# Altium project LEDBO_LRTBR98G_72.PrjPcb
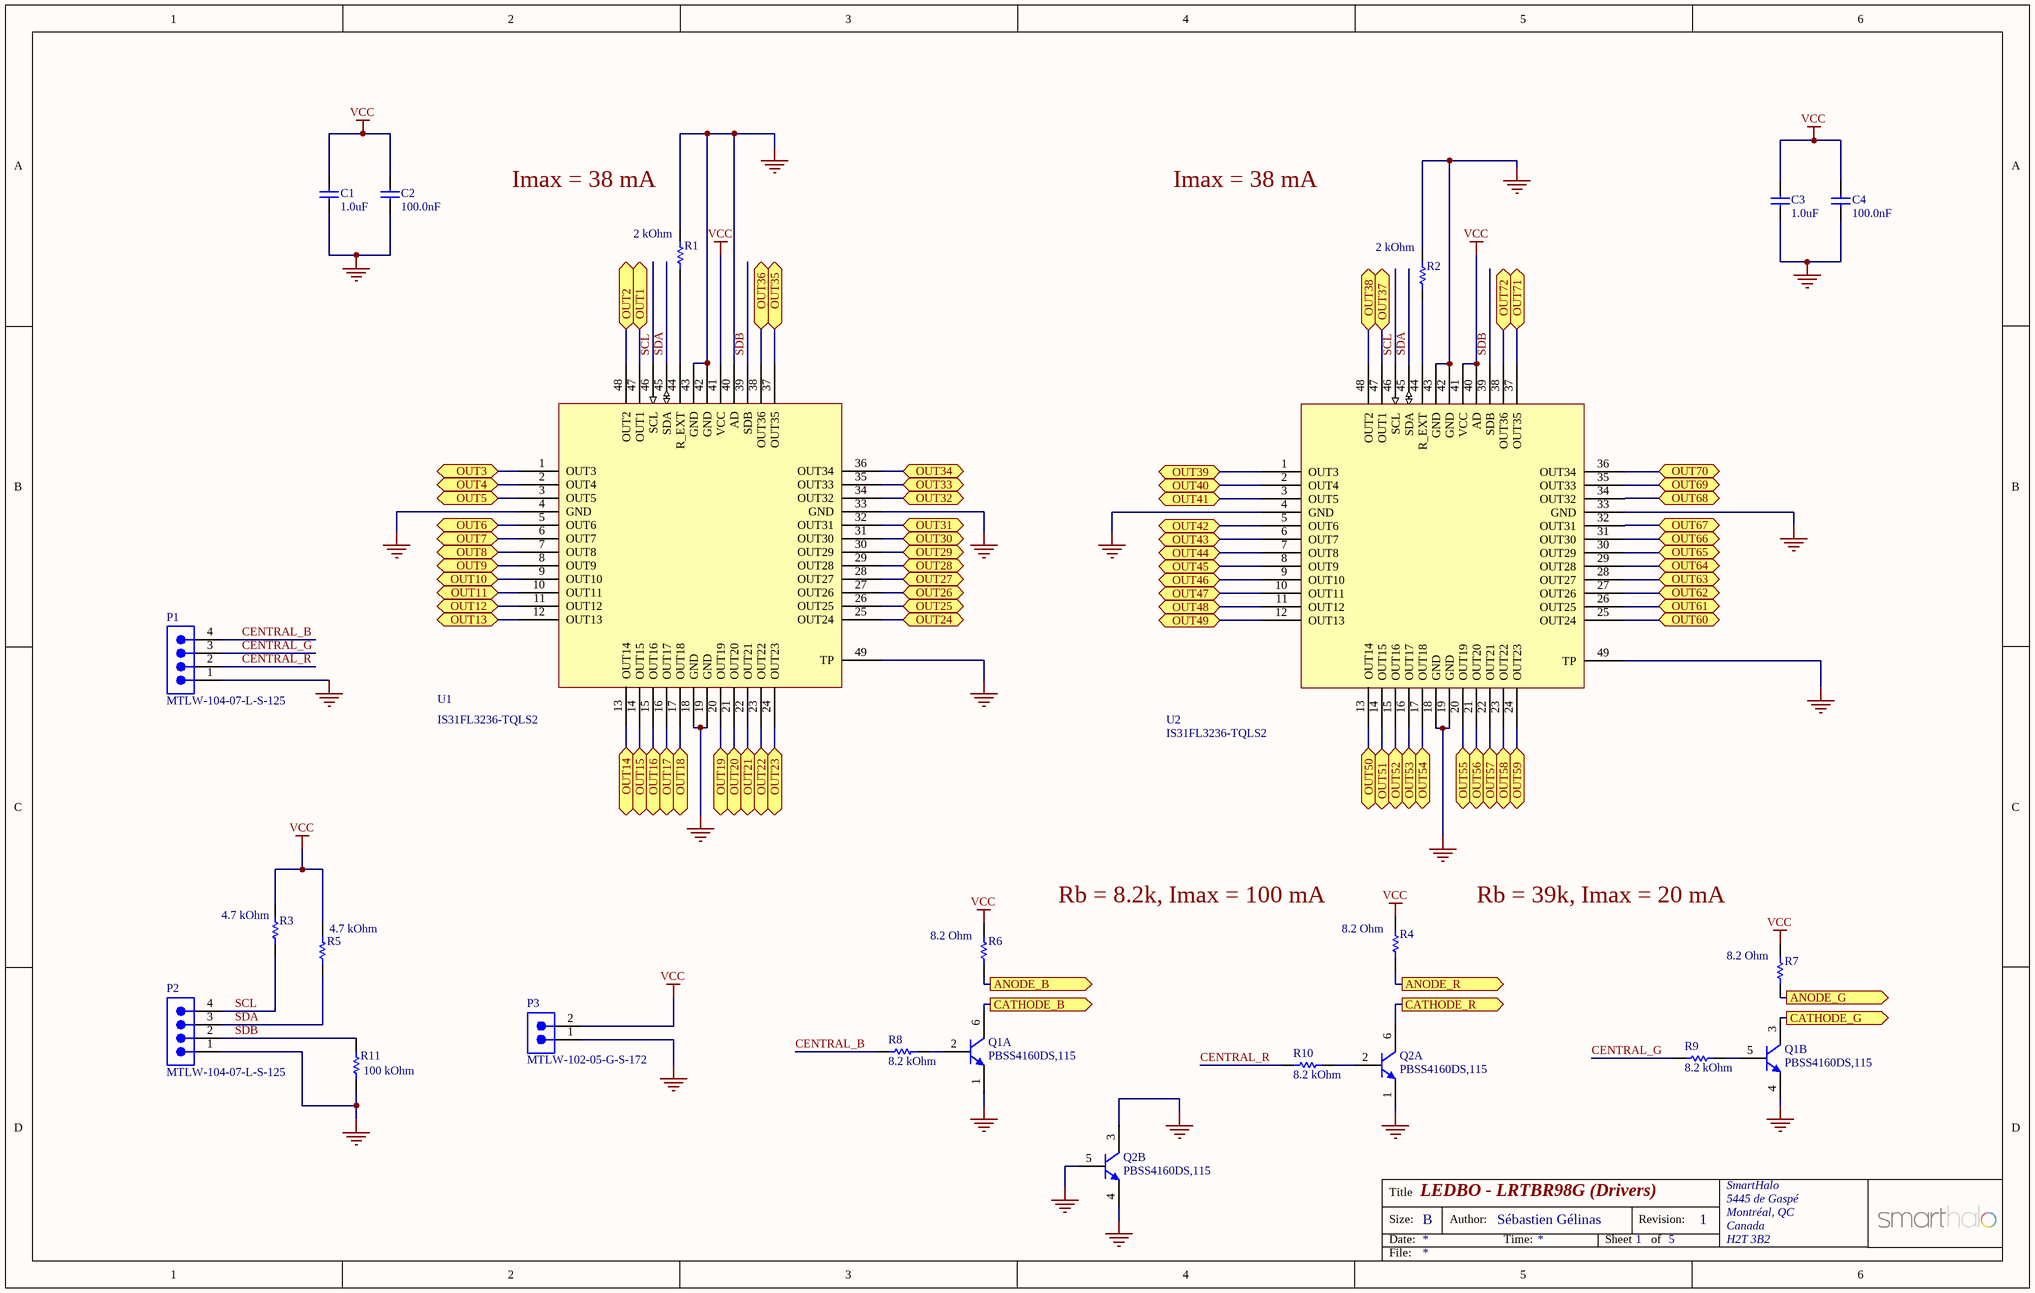
[diagram p0: DRIVERS_CONNECTORS.SchDoc]
5 sheets, 99 parts. Net scope: flat (ports and power ports of the same name join across sheets).
Sheets:
  DRIVERS_CONNECTORS.SchDoc
  LEDS1.SchDoc
  CENTRALLEDS.SchDoc
  LEDS2.SchDoc
  LEDS3.SchDoc

## Sheet DRIVERS_CONNECTORS.SchDoc: LEDBO - LRTBR98G (Drivers)
size B; Author: Sébastien Gélinas; Organization: SmartHalo; Address1: 5445 de Gaspé; Address2: Montréal, QC; Address3: Canada; Address4: H2T 3B2; Revision: 1; SheetNumber: 1; SheetTotal: 5

### Parts
C1  1.0uF  [CAPC0603(1608)100_N]
C2  100.0nF  [CAPC0603(1608)100_N]
C3  1.0uF  [CAPC0603(1608)100_N]
C4  100.0nF  [CAPC0603(1608)100_N]
P1  MTLW-104-07-L-S-125  [SMTC-MTLW-104-07-X-S-125]  (no BOM)
P2  MTLW-104-07-L-S-125  [SMTC-MTLW-104-07-X-S-125]  (no BOM)
P3  MTLW-102-05-G-S-172  [SMTC-MTLW-102-05-X-S-172]  (no BOM)
Q1  PBSS4160DS,115  [NXP-SC74_M]  (parts A,B of 2)
Q2  PBSS4160DS,115  [NXP-SC74_M]  (parts A,B of 2)
R1  2 kOhm  [RESC0603(1608)_N]
R2  2 kOhm  [RESC0603(1608)_N]
R3  4.7 kOhm  [RESC0603(1608)_N]
R4  8.2 Ohm  [RESC0603(1608)_N]
R5  4.7 kOhm  [RESC0603(1608)_N]
R6  8.2 Ohm  [RESC0603(1608)_N]
R7  8.2 Ohm  [RESC0603(1608)_N]
R8  8.2 kOhm  [RESC0603(1608)_N]
R9  8.2 kOhm  [RESC0603(1608)_N]
R10  8.2 kOhm  [RESC0603(1608)_N]
R11  100 kOhm  [RESC0603(1608)_N]
U1  IS31FL3236-TQLS2  [TQFP48]
U2  IS31FL3236-TQLS2  [TQFP48]

### Ports
ANODE_B (out), ANODE_G (out), ANODE_R (out), CATHODE_B (out), CATHODE_G (out), CATHODE_R (out), OUT1, OUT2, OUT3, OUT4, OUT5, OUT6, OUT7, OUT8, OUT9, OUT10, OUT11, OUT12, OUT13, OUT14, OUT15, OUT16, OUT17, OUT18, OUT19, OUT20, OUT21, OUT22, OUT23, OUT24, OUT25, OUT26, OUT27, OUT28, OUT29, OUT30, OUT31, OUT32, OUT33, OUT34, OUT35, OUT36, OUT37, OUT38, OUT39, OUT40, OUT41, OUT42, OUT43, OUT44, OUT45, OUT46, OUT47, OUT48, OUT49, OUT50, OUT51, OUT52, OUT53, OUT54, OUT55, OUT56, OUT57, OUT58, OUT59, OUT60, OUT61, OUT62, OUT63, OUT64, OUT65, OUT66, OUT67, OUT68, OUT69, OUT70, OUT71, OUT72

### Nets
GND: C1.2 C2.2 C3.2 C4.2 P1.1 P2.1 P3.1 Q1.1(E1) Q1.4(E2) Q2.1(E1) Q2.3(C2) Q2.4(E2) Q2.5(B2) R1.2 R2.2 R11.1 U1.4(GND) U1.18(GND) U1.19(GND) U1.33(GND) U1.40(AD) U1.42(GND) U1.43(GND) U1.49(TP) U2.4(GND) U2.18(GND) U2.19(GND) U2.33(GND) U2.42(GND) U2.43(GND) U2.49(TP)
VCC: C1.1 C2.1 C3.1 C4.1 P3.2 R3.2 R4.2 R5.2 R6.2 R7.2 U1.41(VCC) U2.40(AD) U2.41(VCC)
ANODE_B: R6.1 ; port ANODE_B
ANODE_G: R7.1 ; port ANODE_G
ANODE_R: R4.1 ; port ANODE_R
CENTRAL_B: P1.4 R8.2
CENTRAL_G: P1.3 R9.2
CENTRAL_R: P1.2 R10.2
SCL: P2.4 R3.1 U1.46(SCL) U2.46(SCL)
SDA: P2.3 R5.1 U1.45(SDA) U2.45(SDA)
SDB: P2.2 R11.2 U1.39(SDB) U2.39(SDB)
NetLED1_C1: Q1.6(C1) ; port CATHODE_B
NetLED1_C2: Q1.3(C2) ; port CATHODE_G
NetLED1_C3: Q2.6(C1) ; port CATHODE_R
NetLED6_C1: U1.20(OUT19) ; port OUT19
NetLED6_C2: U1.21(OUT20) ; port OUT20
NetLED6_C3: U1.22(OUT21) ; port OUT21
NetLED7_C1: U1.15(OUT16) ; port OUT16
NetLED7_C2: U1.16(OUT17) ; port OUT17
NetLED7_C3: U1.17(OUT18) ; port OUT18
NetLED8_C1: U1.12(OUT13) ; port OUT13
NetLED8_C2: U1.13(OUT14) ; port OUT14
NetLED8_C3: U1.14(OUT15) ; port OUT15
NetLED9_C1: U1.9(OUT10) ; port OUT10
NetLED9_C2: U1.10(OUT11) ; port OUT11
NetLED9_C3: U1.11(OUT12) ; port OUT12
NetLED10_C1: U1.6(OUT7) ; port OUT7
NetLED10_C2: U1.7(OUT8) ; port OUT8
NetLED10_C3: U1.8(OUT9) ; port OUT9
NetLED11_C1: U1.2(OUT4) ; port OUT4
NetLED11_C2: U1.3(OUT5) ; port OUT5
NetLED11_C3: U1.5(OUT6) ; port OUT6
NetLED12_C1: U1.47(OUT1) ; port OUT1
NetLED12_C2: U1.48(OUT2) ; port OUT2
NetLED12_C3: U1.1(OUT3) ; port OUT3
NetLED13_C1: U2.36(OUT34) ; port OUT70
NetLED13_C2: U2.37(OUT35) ; port OUT71
NetLED13_C3: U2.38(OUT36) ; port OUT72
NetLED14_C1: U2.32(OUT31) ; port OUT67
NetLED14_C2: U2.34(OUT32) ; port OUT68
NetLED14_C3: U2.35(OUT33) ; port OUT69
NetLED15_C1: U2.29(OUT28) ; port OUT64
NetLED15_C2: U2.30(OUT29) ; port OUT65
NetLED15_C3: U2.31(OUT30) ; port OUT66
NetLED16_C1: U2.26(OUT25) ; port OUT61
NetLED16_C2: U2.27(OUT26) ; port OUT62
NetLED16_C3: U2.28(OUT27) ; port OUT63
NetLED17_C1: U2.23(OUT22) ; port OUT58
NetLED17_C2: U2.24(OUT23) ; port OUT59
NetLED17_C3: U2.25(OUT24) ; port OUT60
NetLED18_C1: U2.20(OUT19) ; port OUT55
NetLED18_C2: U2.21(OUT20) ; port OUT56
NetLED18_C3: U2.22(OUT21) ; port OUT57
NetLED19_C1: U2.15(OUT16) ; port OUT52
NetLED19_C2: U2.16(OUT17) ; port OUT53
NetLED19_C3: U2.17(OUT18) ; port OUT54
NetLED20_C1: U2.12(OUT13) ; port OUT49
NetLED20_C2: U2.13(OUT14) ; port OUT50
NetLED20_C3: U2.14(OUT15) ; port OUT51
NetLED21_C1: U2.9(OUT10) ; port OUT46
NetLED21_C2: U2.10(OUT11) ; port OUT47
NetLED21_C3: U2.11(OUT12) ; port OUT48
NetLED22_C1: U2.6(OUT7) ; port OUT43
NetLED22_C2: U2.7(OUT8) ; port OUT44
NetLED22_C3: U2.8(OUT9) ; port OUT45
NetLED23_C1: U2.2(OUT4) ; port OUT40
NetLED23_C2: U2.3(OUT5) ; port OUT41
NetLED23_C3: U2.5(OUT6) ; port OUT42
NetLED24_C1: U2.47(OUT1) ; port OUT37
NetLED24_C2: U2.48(OUT2) ; port OUT38
NetLED24_C3: U2.1(OUT3) ; port OUT39
NetLED25_C1: U1.36(OUT34) ; port OUT34
NetLED25_C2: U1.37(OUT35) ; port OUT35
NetLED25_C3: U1.38(OUT36) ; port OUT36
NetLED26_C1: U1.32(OUT31) ; port OUT31
NetLED26_C2: U1.34(OUT32) ; port OUT32
NetLED26_C3: U1.35(OUT33) ; port OUT33
NetLED27_C1: U1.29(OUT28) ; port OUT28
NetLED27_C2: U1.30(OUT29) ; port OUT29
NetLED27_C3: U1.31(OUT30) ; port OUT30
NetLED28_C1: U1.26(OUT25) ; port OUT25
NetLED28_C2: U1.27(OUT26) ; port OUT26
NetLED28_C3: U1.28(OUT27) ; port OUT27
NetLED29_C1: U1.23(OUT22) ; port OUT22
NetLED29_C2: U1.24(OUT23) ; port OUT23
NetLED29_C3: U1.25(OUT24) ; port OUT24
NetQ1_2: Q1.2(B1) R8.1
NetQ1_5: Q1.5(B2) R9.1
NetQ2_2: Q2.2(B1) R10.1
NetR1_1: R1.1 U1.44(R_EXT)
NetR2_1: R2.1 U2.44(R_EXT)

### Notes on the sheet
- (near R1) Imax = 38 mA
- Imax = 38 mA
- Rb = 8.2k, Imax = 100 mA
- Rb = 39k, Imax = 20 mA
- Title
- Size:
- Date:
- B
- Author:
- Time:
- Sheet
- Revision:
- of
- File:

### Library data of the parts
C1-C4 = CAP0603: Chip Cap 0603 X7R 10%; Part Number: C0402-1n0; Note: Chip Cap X7R 10%; Artikkelnr Noca: 20039223; Published: 2009-05-08; LatestRevisionDate: 2009-11-23; Publisher: Nordic Semiconductor; Manufacturer: *; Manufacturer Part Number: *; Datasheet: *; Footprint: 0603; Pin Count: 2; Supplier: *
  C1 C3: Value: 1.0uF
  C2 C4: Value: 100.0nF
P1 P2 = CMP-1024-00072-1: Low Profile .025" SQ Post Header, Through-hole, Vertical, -55 to 125 degC, 2.54 mm Pitch, 4-Pin, Male, RoHS; Manufacturer: Samtec; Pitch: 2.54 mm; PackageDescription: Low Profile Terminal Assembly; PartNumber: MTLW-104-07-L-S-125; PackageReference: MTLW-104-07-X-S-125; ComponentLink1Description: Manufacturer URL; ComponentLink2Description: Datasheet; ComponentLink2URL: http://www.samtec.com/documents/webfiles/pdf/MTLW_TH.PDF; ComponentLink3Description: Package Specification; Mounting Technology: Through-hole; ComponentLink3URL: http://www.samtec.com/documents/webfiles/cpdf/MTLW-1XX-XX-XX-X-XXX-XX-XX-MKT1.pdf; ComponentLink1URL: http://www.samtec.com; Orientation: Vertical; PackageVersion: T, 6/1991; DatasheetVersion: F-214; Temperature Range: -55 to 125 degC; RoHS: True
P3 = CMP-1024-00064-1: Low Profile .025" SQ Post Header, Through-hole, Vertical, -55 to 125 degC, 2.54 mm Pitch, 2-Pin, Male, RoHS; Manufacturer: Samtec; Pitch: 2.54 mm; ComponentLink2URL: http://www.samtec.com/documents/webfiles/pdf/MTLW_TH.PDF; PackageDescription: Low Profile Terminal Assembly; ComponentLink3URL: http://www.samtec.com/documents/webfiles/cpdf/MTLW-1XX-XX-XX-X-XXX-XX-XX-MKT1.pdf; PackageReference: MTLW-102-05-X-S-172; Mounting Technology: Through-hole; ComponentLink2Description: Datasheet; PackageVersion: T, 6/1991; Orientation: Vertical; DatasheetVersion: F-214; RoHS: True; ComponentLink3Description: Package Specification; ComponentLink1URL: http://www.samtec.com; Temperature Range: -55 to 125 degC; PartNumber: MTLW-102-05-G-S-172; ComponentLink1Description: Manufacturer URL
Q1 Q2 = PBSS4160DS,115: TRANS 2NPN 60V 1A 6TSOP; Manufacturer: NXP Semiconductors; Polarity: NPN; Mounting Technology: Surface Mount; PackageDescription: 6-Pin Semiconductor Package, 2.9 x 1.6 mm Body, 0.95 mm Pitch; PackageReference: SC74; PartNumber: PBSS4160DS; Manufacturer Part Number: PBSS4160DS,115; Digi-Key Part Number: 568-4350-1-ND
R1 R2 = CMP-1012-00090-1: 2k 0.1W 5% 0603 (1608 Metric)  SMD; Case-Metric: 1608; Case-EIA: 0603; Tolerance: 5 %; Technology: SMT; Power: 0.1 W; Value: 2 kOhm
R3 R5 = CMP-1012-00090-1: 4K7 0.1W 5% 0603 (1608 Metric)  SMD; Case-Metric: 1608; Case-EIA: 0603; Tolerance: 5 %; Technology: SMT; Power: 0.1 W; Value: 4.7 kOhm
R4 R6 R7 = CMP-1012-00090-1: 8R2 0.1W 5% 0603 (1608 Metric)  SMD; Case-Metric: 1608; Case-EIA: 0603; Tolerance: 5 %; Technology: SMT; Power: 0.1 W; Value: 8.2 Ohm
R8-R10 = CMP-1012-00090-1: 8K2 0.1W 5% 0603 (1608 Metric)  SMD; Case-Metric: 1608; Case-EIA: 0603; Tolerance: 5 %; Technology: SMT; Power: 0.1 W; Value: 8.2 kOhm
R11 = CMP-1012-00090-1: 100k 0.1W 5% 0603 (1608 Metric)  SMD; Case-Metric: 1608; Case-EIA: 0603; Tolerance: 5 %; Technology: SMT; Power: 0.1 W; Value: 100 kOhm
U1 U2 = IS31FL3236-TQLS2: IC 36 CHANNELS LED DRIVER; Manufacturer: ISSI; Manufacturer Part Number: IS31FL3236-TQLS2

## Sheet LEDS1.SchDoc: LEDBO - LRTBR98G (LEDS 1)
size B; Author: Sébastien Gélinas; Organization: SmartHalo; Address1: 5445 de Gaspé; Address2: Montréal, QC; Address3: Canada; Address4: H2T 3B2; Revision: 1; SheetNumber: 3; SheetTotal: 5
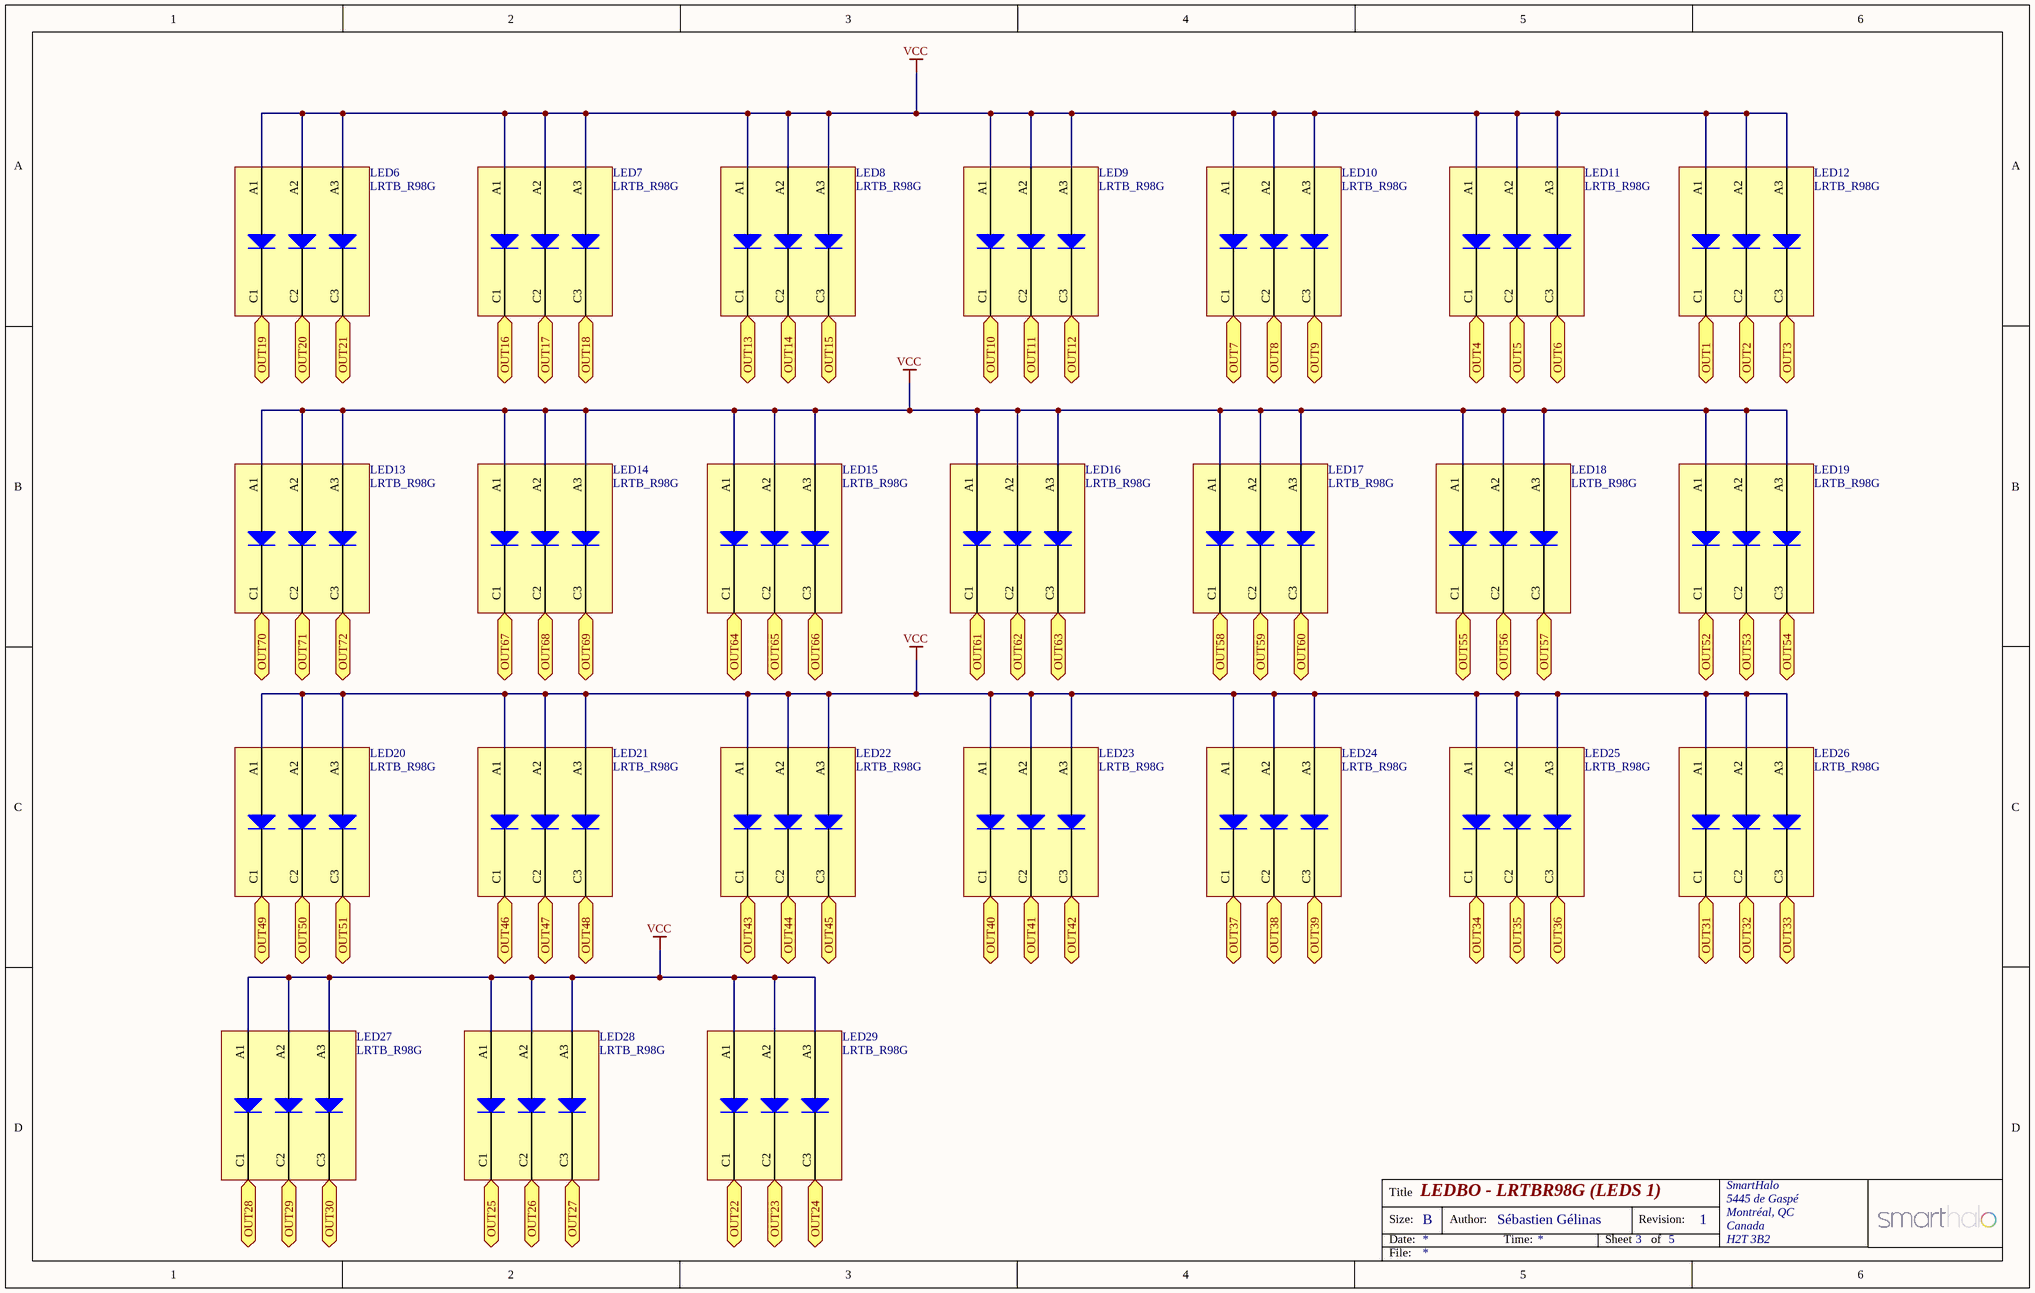
[diagram p1: LEDS1.SchDoc]

### Parts
LED6  LRTB_R98G  [LRTB_R98G]
LED7  LRTB_R98G  [LRTB_R98G]
LED8  LRTB_R98G  [LRTB_R98G]
LED9  LRTB_R98G  [LRTB_R98G]
LED10  LRTB_R98G  [LRTB_R98G]
LED11  LRTB_R98G  [LRTB_R98G]
LED12  LRTB_R98G  [LRTB_R98G]
LED13  LRTB_R98G  [LRTB_R98G]
LED14  LRTB_R98G  [LRTB_R98G]
LED15  LRTB_R98G  [LRTB_R98G]
LED16  LRTB_R98G  [LRTB_R98G]
LED17  LRTB_R98G  [LRTB_R98G]
LED18  LRTB_R98G  [LRTB_R98G]
LED19  LRTB_R98G  [LRTB_R98G]
LED20  LRTB_R98G  [LRTB_R98G]
LED21  LRTB_R98G  [LRTB_R98G]
LED22  LRTB_R98G  [LRTB_R98G]
LED23  LRTB_R98G  [LRTB_R98G]
LED24  LRTB_R98G  [LRTB_R98G]
LED25  LRTB_R98G  [LRTB_R98G]
LED26  LRTB_R98G  [LRTB_R98G]
LED27  LRTB_R98G  [LRTB_R98G]
LED28  LRTB_R98G  [LRTB_R98G]
LED29  LRTB_R98G  [LRTB_R98G]

### Ports
OUT1, OUT2, OUT3, OUT4, OUT5, OUT6, OUT7, OUT8, OUT9, OUT10, OUT11, OUT12, OUT13, OUT14, OUT15, OUT16, OUT17, OUT18, OUT19, OUT20, OUT21, OUT22, OUT23, OUT24, OUT25, OUT26, OUT27, OUT28, OUT29, OUT30, OUT31, OUT32, OUT33, OUT34, OUT35, OUT36, OUT37, OUT38, OUT39, OUT40, OUT41, OUT42, OUT43, OUT44, OUT45, OUT46, OUT47, OUT48, OUT49, OUT50, OUT51, OUT52, OUT53, OUT54, OUT55, OUT56, OUT57, OUT58, OUT59, OUT60, OUT61, OUT62, OUT63, OUT64, OUT65, OUT66, OUT67, OUT68, OUT69, OUT70, OUT71, OUT72

### Nets
VCC: LED6.A1(Anode_Blue) LED6.A2(Anode_Green) LED6.A3(Anode_Red) LED7.A1(Anode_Blue) LED7.A2(Anode_Green) LED7.A3(Anode_Red) LED8.A1(Anode_Blue) LED8.A2(Anode_Green) LED8.A3(Anode_Red) LED9.A1(Anode_Blue) LED9.A2(Anode_Green) LED9.A3(Anode_Red) LED10.A1(Anode_Blue) LED10.A2(Anode_Green) LED10.A3(Anode_Red) LED11.A1(Anode_Blue) LED11.A2(Anode_Green) LED11.A3(Anode_Red) LED12.A1(Anode_Blue) LED12.A2(Anode_Green) LED12.A3(Anode_Red) LED13.A1(Anode_Blue) LED13.A2(Anode_Green) LED13.A3(Anode_Red) LED14.A1(Anode_Blue) LED14.A2(Anode_Green) LED14.A3(Anode_Red) LED15.A1(Anode_Blue) LED15.A2(Anode_Green) LED15.A3(Anode_Red) LED16.A1(Anode_Blue) LED16.A2(Anode_Green) LED16.A3(Anode_Red) LED17.A1(Anode_Blue) LED17.A2(Anode_Green) LED17.A3(Anode_Red) LED18.A1(Anode_Blue) LED18.A2(Anode_Green) LED18.A3(Anode_Red) LED19.A1(Anode_Blue) LED19.A2(Anode_Green) LED19.A3(Anode_Red) LED20.A1(Anode_Blue) LED20.A2(Anode_Green) LED20.A3(Anode_Red) LED21.A1(Anode_Blue) LED21.A2(Anode_Green) LED21.A3(Anode_Red) LED22.A1(Anode_Blue) LED22.A2(Anode_Green) LED22.A3(Anode_Red) LED23.A1(Anode_Blue) LED23.A2(Anode_Green) LED23.A3(Anode_Red) LED24.A1(Anode_Blue) LED24.A2(Anode_Green) LED24.A3(Anode_Red) LED25.A1(Anode_Blue) LED25.A2(Anode_Green) LED25.A3(Anode_Red) LED26.A1(Anode_Blue) LED26.A2(Anode_Green) LED26.A3(Anode_Red) LED27.A1(Anode_Blue) LED27.A2(Anode_Green) LED27.A3(Anode_Red) LED28.A1(Anode_Blue) LED28.A2(Anode_Green) LED28.A3(Anode_Red) LED29.A1(Anode_Blue) LED29.A2(Anode_Green) LED29.A3(Anode_Red)
NetLED6_C1: LED6.C1(Cathode_Blue) ; port OUT19
NetLED6_C2: LED6.C2(Cathode_Green) ; port OUT20
NetLED6_C3: LED6.C3(Cathode_Red) ; port OUT21
NetLED7_C1: LED7.C1(Cathode_Blue) ; port OUT16
NetLED7_C2: LED7.C2(Cathode_Green) ; port OUT17
NetLED7_C3: LED7.C3(Cathode_Red) ; port OUT18
NetLED8_C1: LED8.C1(Cathode_Blue) ; port OUT13
NetLED8_C2: LED8.C2(Cathode_Green) ; port OUT14
NetLED8_C3: LED8.C3(Cathode_Red) ; port OUT15
NetLED9_C1: LED9.C1(Cathode_Blue) ; port OUT10
NetLED9_C2: LED9.C2(Cathode_Green) ; port OUT11
NetLED9_C3: LED9.C3(Cathode_Red) ; port OUT12
NetLED10_C1: LED10.C1(Cathode_Blue) ; port OUT7
NetLED10_C2: LED10.C2(Cathode_Green) ; port OUT8
NetLED10_C3: LED10.C3(Cathode_Red) ; port OUT9
NetLED11_C1: LED11.C1(Cathode_Blue) ; port OUT4
NetLED11_C2: LED11.C2(Cathode_Green) ; port OUT5
NetLED11_C3: LED11.C3(Cathode_Red) ; port OUT6
NetLED12_C1: LED12.C1(Cathode_Blue) ; port OUT1
NetLED12_C2: LED12.C2(Cathode_Green) ; port OUT2
NetLED12_C3: LED12.C3(Cathode_Red) ; port OUT3
NetLED13_C1: LED13.C1(Cathode_Blue) ; port OUT70
NetLED13_C2: LED13.C2(Cathode_Green) ; port OUT71
NetLED13_C3: LED13.C3(Cathode_Red) ; port OUT72
NetLED14_C1: LED14.C1(Cathode_Blue) ; port OUT67
NetLED14_C2: LED14.C2(Cathode_Green) ; port OUT68
NetLED14_C3: LED14.C3(Cathode_Red) ; port OUT69
NetLED15_C1: LED15.C1(Cathode_Blue) ; port OUT64
NetLED15_C2: LED15.C2(Cathode_Green) ; port OUT65
NetLED15_C3: LED15.C3(Cathode_Red) ; port OUT66
NetLED16_C1: LED16.C1(Cathode_Blue) ; port OUT61
NetLED16_C2: LED16.C2(Cathode_Green) ; port OUT62
NetLED16_C3: LED16.C3(Cathode_Red) ; port OUT63
NetLED17_C1: LED17.C1(Cathode_Blue) ; port OUT58
NetLED17_C2: LED17.C2(Cathode_Green) ; port OUT59
NetLED17_C3: LED17.C3(Cathode_Red) ; port OUT60
NetLED18_C1: LED18.C1(Cathode_Blue) ; port OUT55
NetLED18_C2: LED18.C2(Cathode_Green) ; port OUT56
NetLED18_C3: LED18.C3(Cathode_Red) ; port OUT57
NetLED19_C1: LED19.C1(Cathode_Blue) ; port OUT52
NetLED19_C2: LED19.C2(Cathode_Green) ; port OUT53
NetLED19_C3: LED19.C3(Cathode_Red) ; port OUT54
NetLED20_C1: LED20.C1(Cathode_Blue) ; port OUT49
NetLED20_C2: LED20.C2(Cathode_Green) ; port OUT50
NetLED20_C3: LED20.C3(Cathode_Red) ; port OUT51
NetLED21_C1: LED21.C1(Cathode_Blue) ; port OUT46
NetLED21_C2: LED21.C2(Cathode_Green) ; port OUT47
NetLED21_C3: LED21.C3(Cathode_Red) ; port OUT48
NetLED22_C1: LED22.C1(Cathode_Blue) ; port OUT43
NetLED22_C2: LED22.C2(Cathode_Green) ; port OUT44
NetLED22_C3: LED22.C3(Cathode_Red) ; port OUT45
NetLED23_C1: LED23.C1(Cathode_Blue) ; port OUT40
NetLED23_C2: LED23.C2(Cathode_Green) ; port OUT41
NetLED23_C3: LED23.C3(Cathode_Red) ; port OUT42
NetLED24_C1: LED24.C1(Cathode_Blue) ; port OUT37
NetLED24_C2: LED24.C2(Cathode_Green) ; port OUT38
NetLED24_C3: LED24.C3(Cathode_Red) ; port OUT39
NetLED25_C1: LED25.C1(Cathode_Blue) ; port OUT34
NetLED25_C2: LED25.C2(Cathode_Green) ; port OUT35
NetLED25_C3: LED25.C3(Cathode_Red) ; port OUT36
NetLED26_C1: LED26.C1(Cathode_Blue) ; port OUT31
NetLED26_C2: LED26.C2(Cathode_Green) ; port OUT32
NetLED26_C3: LED26.C3(Cathode_Red) ; port OUT33
NetLED27_C1: LED27.C1(Cathode_Blue) ; port OUT28
NetLED27_C2: LED27.C2(Cathode_Green) ; port OUT29
NetLED27_C3: LED27.C3(Cathode_Red) ; port OUT30
NetLED28_C1: LED28.C1(Cathode_Blue) ; port OUT25
NetLED28_C2: LED28.C2(Cathode_Green) ; port OUT26
NetLED28_C3: LED28.C3(Cathode_Red) ; port OUT27
NetLED29_C1: LED29.C1(Cathode_Blue) ; port OUT22
NetLED29_C2: LED29.C2(Cathode_Green) ; port OUT23
NetLED29_C3: LED29.C3(Cathode_Red) ; port OUT24

### Notes on the sheet
- Title
- Size:
- Date:
- B
- Author:
- Time:
- Sheet
- Revision:
- of
- File:

### Library data of the parts
LED6-LED29 = LRTB_R98G: IC RGB LED OSRAM; Manufacturer: OSRAM

## Sheet CENTRALLEDS.SchDoc: LEDBO - LRTBR98G (Central LED)
size B; Author: Sébastien Gélinas; Organization: SmartHalo; Address1: 5445 de Gaspé; Address2: Montréal, QC; Address3: Canada; Address4: H2T 3B2; Revision: 1; SheetNumber: 2; SheetTotal: 5
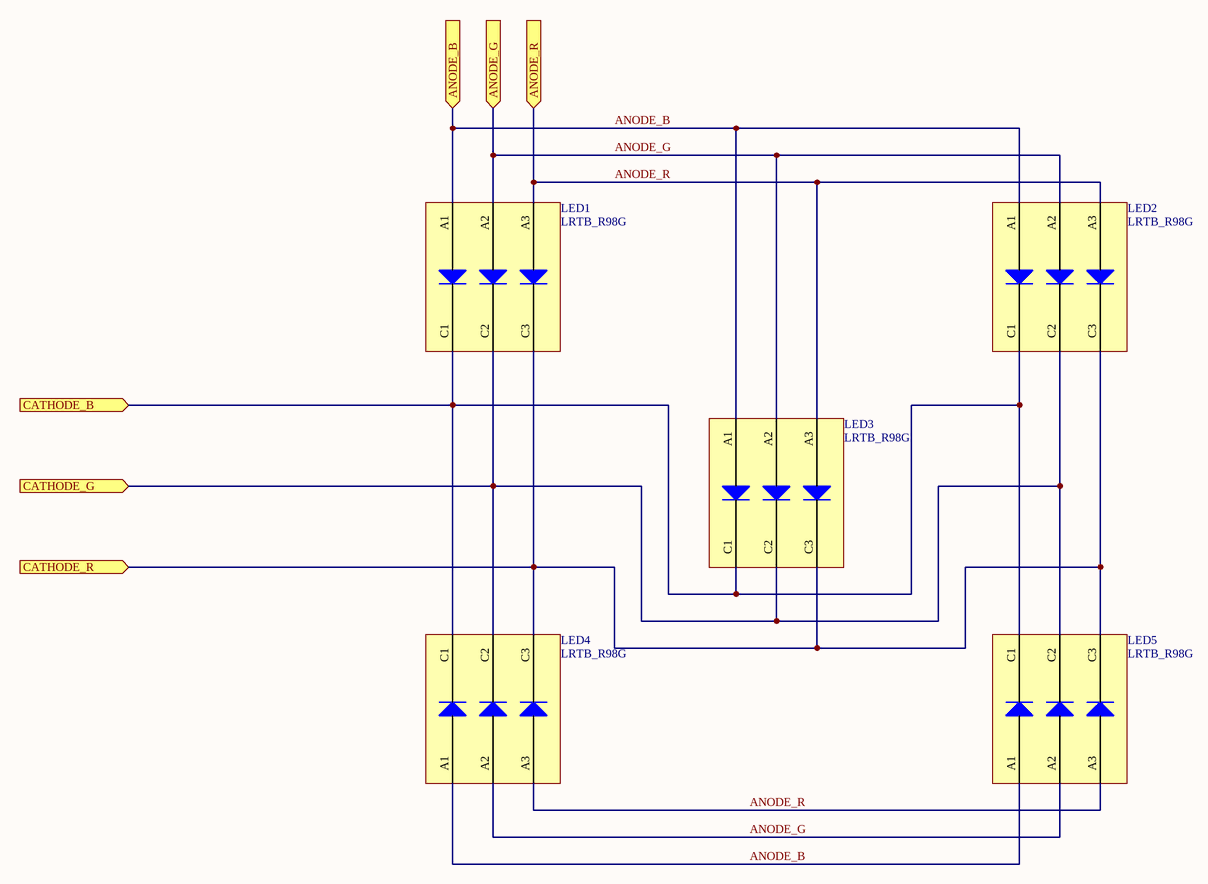
[diagram p2: CENTRALLEDS.SchDoc]

### Parts
LED1  LRTB_R98G  [LRTB_R98G]
LED2  LRTB_R98G  [LRTB_R98G]
LED3  LRTB_R98G  [LRTB_R98G]
LED4  LRTB_R98G  [LRTB_R98G]
LED5  LRTB_R98G  [LRTB_R98G]

### Ports
ANODE_B (in), ANODE_G (in), ANODE_R (in), CATHODE_B (in), CATHODE_G (in), CATHODE_R (in)

### Nets
ANODE_B: LED1.A1(Anode_Blue) LED2.A1(Anode_Blue) LED3.A1(Anode_Blue) LED4.A1(Anode_Blue) LED5.A1(Anode_Blue) ; port ANODE_B
ANODE_G: LED1.A2(Anode_Green) LED2.A2(Anode_Green) LED3.A2(Anode_Green) LED4.A2(Anode_Green) LED5.A2(Anode_Green) ; port ANODE_G
ANODE_R: LED1.A3(Anode_Red) LED2.A3(Anode_Red) LED3.A3(Anode_Red) LED4.A3(Anode_Red) LED5.A3(Anode_Red) ; port ANODE_R
NetLED1_C1: LED1.C1(Cathode_Blue) LED2.C1(Cathode_Blue) LED3.C1(Cathode_Blue) LED4.C1(Cathode_Blue) LED5.C1(Cathode_Blue) ; port CATHODE_B
NetLED1_C2: LED1.C2(Cathode_Green) LED2.C2(Cathode_Green) LED3.C2(Cathode_Green) LED4.C2(Cathode_Green) LED5.C2(Cathode_Green) ; port CATHODE_G
NetLED1_C3: LED1.C3(Cathode_Red) LED2.C3(Cathode_Red) LED3.C3(Cathode_Red) LED4.C3(Cathode_Red) LED5.C3(Cathode_Red) ; port CATHODE_R

### Notes on the sheet
- Title
- Size:
- Date:
- B
- Author:
- Time:
- Sheet
- Revision:
- of
- File:

### Library data of the parts
LED1-LED5 = LRTB_R98G: IC RGB LED OSRAM; Manufacturer: OSRAM

## Sheet LEDS2.SchDoc: LEDBO - LRTBR98G (LEDS 2)
size B; Author: Sébastien Gélinas; Organization: SmartHalo; Address1: 5445 de Gaspé; Address2: Montréal, QC; Address3: Canada; Address4: H2T 3B2; Revision: 1; SheetNumber: 4; SheetTotal: 5
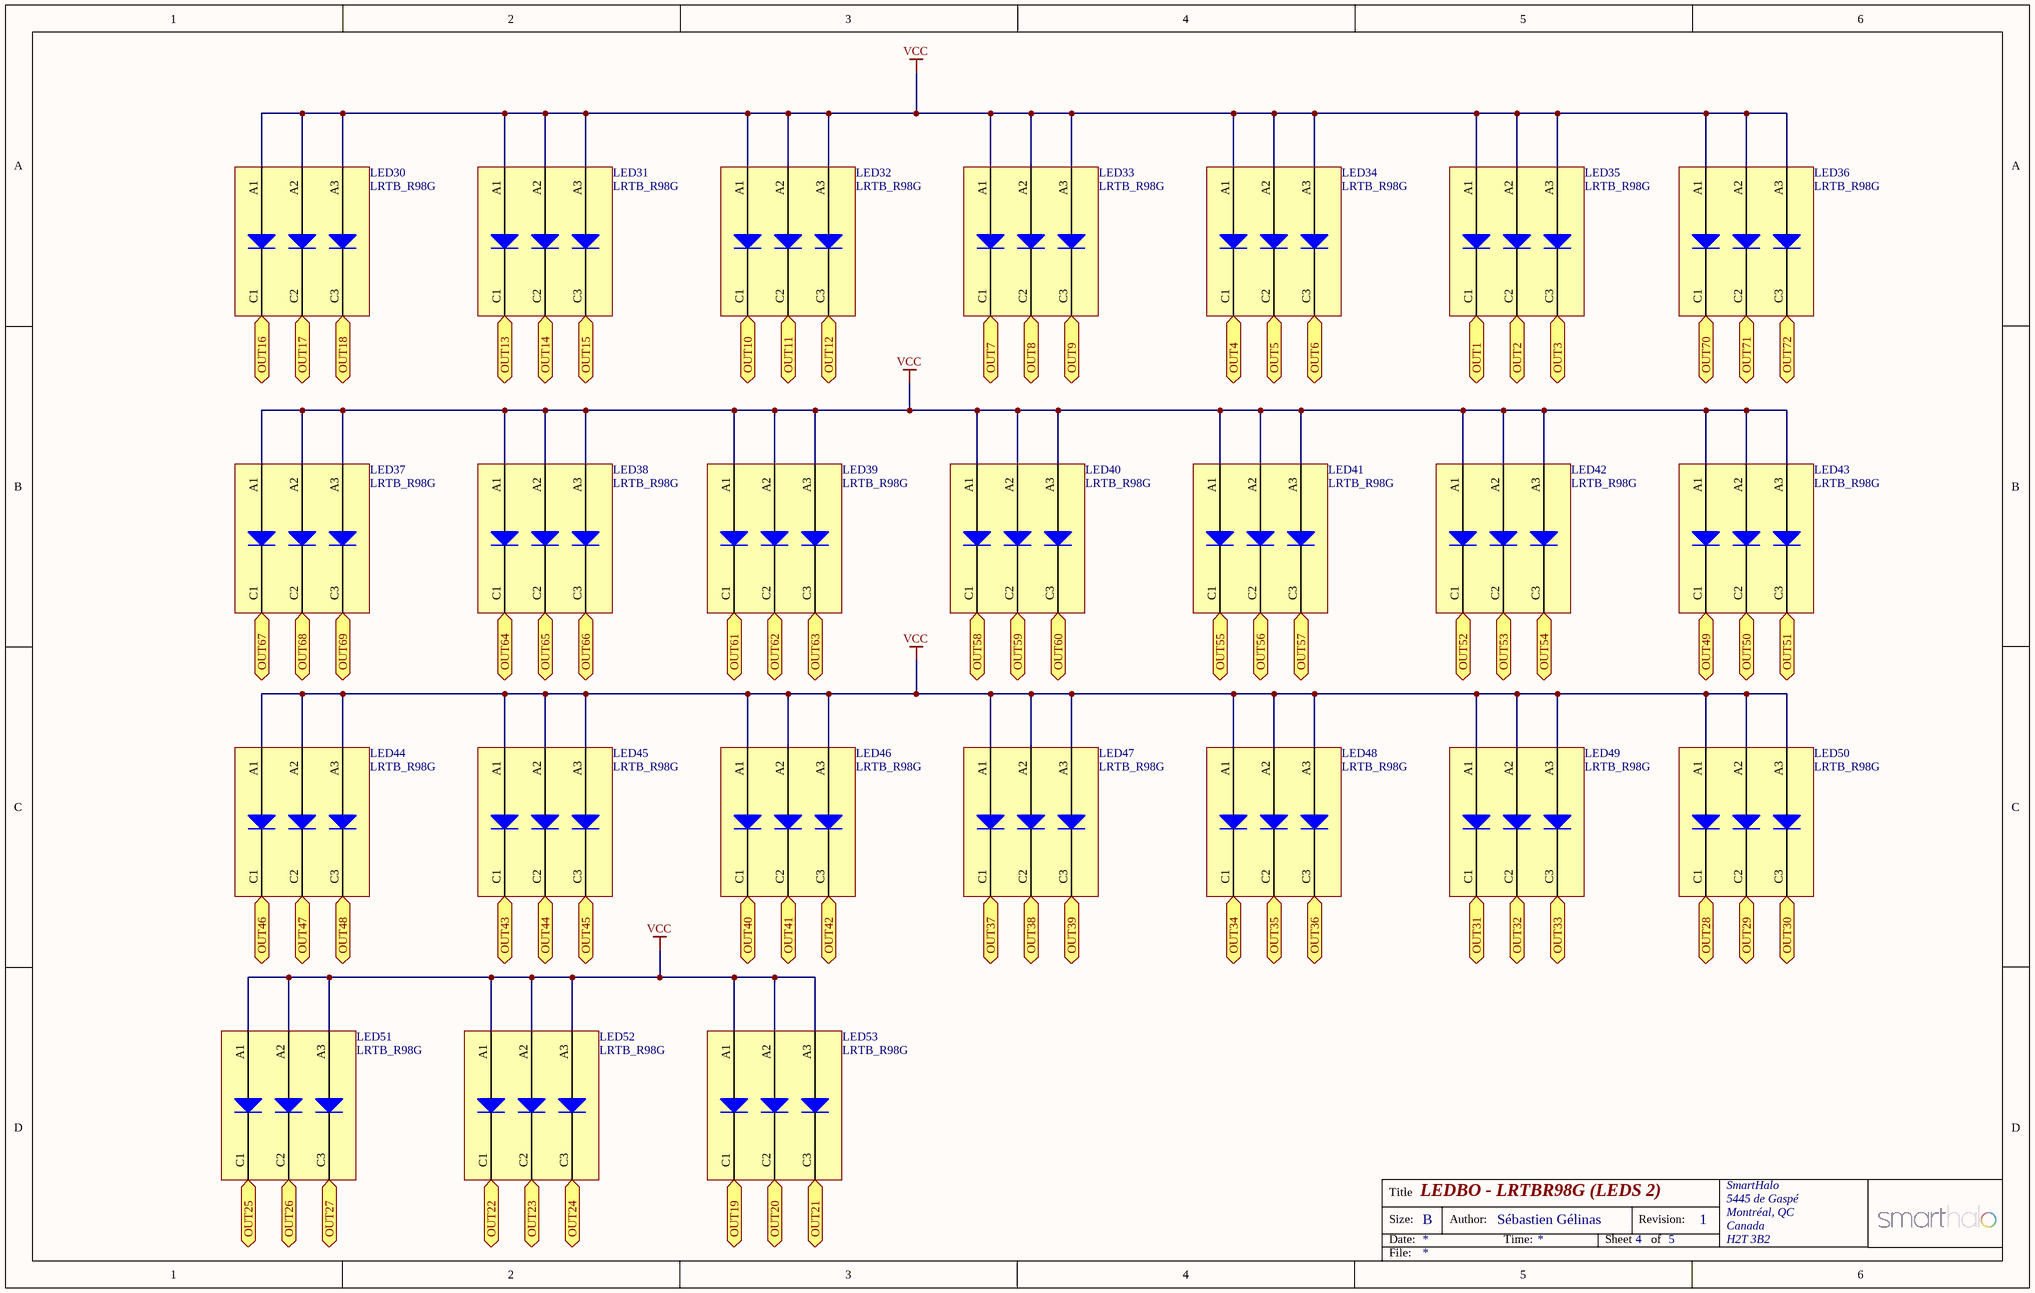
[diagram p3: LEDS2.SchDoc]

### Parts
LED30  LRTB_R98G  [LRTB_R98G]
LED31  LRTB_R98G  [LRTB_R98G]
LED32  LRTB_R98G  [LRTB_R98G]
LED33  LRTB_R98G  [LRTB_R98G]
LED34  LRTB_R98G  [LRTB_R98G]
LED35  LRTB_R98G  [LRTB_R98G]
LED36  LRTB_R98G  [LRTB_R98G]
LED37  LRTB_R98G  [LRTB_R98G]
LED38  LRTB_R98G  [LRTB_R98G]
LED39  LRTB_R98G  [LRTB_R98G]
LED40  LRTB_R98G  [LRTB_R98G]
LED41  LRTB_R98G  [LRTB_R98G]
LED42  LRTB_R98G  [LRTB_R98G]
LED43  LRTB_R98G  [LRTB_R98G]
LED44  LRTB_R98G  [LRTB_R98G]
LED45  LRTB_R98G  [LRTB_R98G]
LED46  LRTB_R98G  [LRTB_R98G]
LED47  LRTB_R98G  [LRTB_R98G]
LED48  LRTB_R98G  [LRTB_R98G]
LED49  LRTB_R98G  [LRTB_R98G]
LED50  LRTB_R98G  [LRTB_R98G]
LED51  LRTB_R98G  [LRTB_R98G]
LED52  LRTB_R98G  [LRTB_R98G]
LED53  LRTB_R98G  [LRTB_R98G]

### Ports
OUT1, OUT2, OUT3, OUT4, OUT5, OUT6, OUT7, OUT8, OUT9, OUT10, OUT11, OUT12, OUT13, OUT14, OUT15, OUT16, OUT17, OUT18, OUT19, OUT20, OUT21, OUT22, OUT23, OUT24, OUT25, OUT26, OUT27, OUT28, OUT29, OUT30, OUT31, OUT32, OUT33, OUT34, OUT35, OUT36, OUT37, OUT38, OUT39, OUT40, OUT41, OUT42, OUT43, OUT44, OUT45, OUT46, OUT47, OUT48, OUT49, OUT50, OUT51, OUT52, OUT53, OUT54, OUT55, OUT56, OUT57, OUT58, OUT59, OUT60, OUT61, OUT62, OUT63, OUT64, OUT65, OUT66, OUT67, OUT68, OUT69, OUT70, OUT71, OUT72

### Nets
VCC: LED30.A1(Anode_Blue) LED30.A2(Anode_Green) LED30.A3(Anode_Red) LED31.A1(Anode_Blue) LED31.A2(Anode_Green) LED31.A3(Anode_Red) LED32.A1(Anode_Blue) LED32.A2(Anode_Green) LED32.A3(Anode_Red) LED33.A1(Anode_Blue) LED33.A2(Anode_Green) LED33.A3(Anode_Red) LED34.A1(Anode_Blue) LED34.A2(Anode_Green) LED34.A3(Anode_Red) LED35.A1(Anode_Blue) LED35.A2(Anode_Green) LED35.A3(Anode_Red) LED36.A1(Anode_Blue) LED36.A2(Anode_Green) LED36.A3(Anode_Red) LED37.A1(Anode_Blue) LED37.A2(Anode_Green) LED37.A3(Anode_Red) LED38.A1(Anode_Blue) LED38.A2(Anode_Green) LED38.A3(Anode_Red) LED39.A1(Anode_Blue) LED39.A2(Anode_Green) LED39.A3(Anode_Red) LED40.A1(Anode_Blue) LED40.A2(Anode_Green) LED40.A3(Anode_Red) LED41.A1(Anode_Blue) LED41.A2(Anode_Green) LED41.A3(Anode_Red) LED42.A1(Anode_Blue) LED42.A2(Anode_Green) LED42.A3(Anode_Red) LED43.A1(Anode_Blue) LED43.A2(Anode_Green) LED43.A3(Anode_Red) LED44.A1(Anode_Blue) LED44.A2(Anode_Green) LED44.A3(Anode_Red) LED45.A1(Anode_Blue) LED45.A2(Anode_Green) LED45.A3(Anode_Red) LED46.A1(Anode_Blue) LED46.A2(Anode_Green) LED46.A3(Anode_Red) LED47.A1(Anode_Blue) LED47.A2(Anode_Green) LED47.A3(Anode_Red) LED48.A1(Anode_Blue) LED48.A2(Anode_Green) LED48.A3(Anode_Red) LED49.A1(Anode_Blue) LED49.A2(Anode_Green) LED49.A3(Anode_Red) LED50.A1(Anode_Blue) LED50.A2(Anode_Green) LED50.A3(Anode_Red) LED51.A1(Anode_Blue) LED51.A2(Anode_Green) LED51.A3(Anode_Red) LED52.A1(Anode_Blue) LED52.A2(Anode_Green) LED52.A3(Anode_Red) LED53.A1(Anode_Blue) LED53.A2(Anode_Green) LED53.A3(Anode_Red)
NetLED6_C1: LED53.C1(Cathode_Blue) ; port OUT19
NetLED6_C2: LED53.C2(Cathode_Green) ; port OUT20
NetLED6_C3: LED53.C3(Cathode_Red) ; port OUT21
NetLED7_C1: LED30.C1(Cathode_Blue) ; port OUT16
NetLED7_C2: LED30.C2(Cathode_Green) ; port OUT17
NetLED7_C3: LED30.C3(Cathode_Red) ; port OUT18
NetLED8_C1: LED31.C1(Cathode_Blue) ; port OUT13
NetLED8_C2: LED31.C2(Cathode_Green) ; port OUT14
NetLED8_C3: LED31.C3(Cathode_Red) ; port OUT15
NetLED9_C1: LED32.C1(Cathode_Blue) ; port OUT10
NetLED9_C2: LED32.C2(Cathode_Green) ; port OUT11
NetLED9_C3: LED32.C3(Cathode_Red) ; port OUT12
NetLED10_C1: LED33.C1(Cathode_Blue) ; port OUT7
NetLED10_C2: LED33.C2(Cathode_Green) ; port OUT8
NetLED10_C3: LED33.C3(Cathode_Red) ; port OUT9
NetLED11_C1: LED34.C1(Cathode_Blue) ; port OUT4
NetLED11_C2: LED34.C2(Cathode_Green) ; port OUT5
NetLED11_C3: LED34.C3(Cathode_Red) ; port OUT6
NetLED12_C1: LED35.C1(Cathode_Blue) ; port OUT1
NetLED12_C2: LED35.C2(Cathode_Green) ; port OUT2
NetLED12_C3: LED35.C3(Cathode_Red) ; port OUT3
NetLED13_C1: LED36.C1(Cathode_Blue) ; port OUT70
NetLED13_C2: LED36.C2(Cathode_Green) ; port OUT71
NetLED13_C3: LED36.C3(Cathode_Red) ; port OUT72
NetLED14_C1: LED37.C1(Cathode_Blue) ; port OUT67
NetLED14_C2: LED37.C2(Cathode_Green) ; port OUT68
NetLED14_C3: LED37.C3(Cathode_Red) ; port OUT69
NetLED15_C1: LED38.C1(Cathode_Blue) ; port OUT64
NetLED15_C2: LED38.C2(Cathode_Green) ; port OUT65
NetLED15_C3: LED38.C3(Cathode_Red) ; port OUT66
NetLED16_C1: LED39.C1(Cathode_Blue) ; port OUT61
NetLED16_C2: LED39.C2(Cathode_Green) ; port OUT62
NetLED16_C3: LED39.C3(Cathode_Red) ; port OUT63
NetLED17_C1: LED40.C1(Cathode_Blue) ; port OUT58
NetLED17_C2: LED40.C2(Cathode_Green) ; port OUT59
NetLED17_C3: LED40.C3(Cathode_Red) ; port OUT60
NetLED18_C1: LED41.C1(Cathode_Blue) ; port OUT55
NetLED18_C2: LED41.C2(Cathode_Green) ; port OUT56
NetLED18_C3: LED41.C3(Cathode_Red) ; port OUT57
NetLED19_C1: LED42.C1(Cathode_Blue) ; port OUT52
NetLED19_C2: LED42.C2(Cathode_Green) ; port OUT53
NetLED19_C3: LED42.C3(Cathode_Red) ; port OUT54
NetLED20_C1: LED43.C1(Cathode_Blue) ; port OUT49
NetLED20_C2: LED43.C2(Cathode_Green) ; port OUT50
NetLED20_C3: LED43.C3(Cathode_Red) ; port OUT51
NetLED21_C1: LED44.C1(Cathode_Blue) ; port OUT46
NetLED21_C2: LED44.C2(Cathode_Green) ; port OUT47
NetLED21_C3: LED44.C3(Cathode_Red) ; port OUT48
NetLED22_C1: LED45.C1(Cathode_Blue) ; port OUT43
NetLED22_C2: LED45.C2(Cathode_Green) ; port OUT44
NetLED22_C3: LED45.C3(Cathode_Red) ; port OUT45
NetLED23_C1: LED46.C1(Cathode_Blue) ; port OUT40
NetLED23_C2: LED46.C2(Cathode_Green) ; port OUT41
NetLED23_C3: LED46.C3(Cathode_Red) ; port OUT42
NetLED24_C1: LED47.C1(Cathode_Blue) ; port OUT37
NetLED24_C2: LED47.C2(Cathode_Green) ; port OUT38
NetLED24_C3: LED47.C3(Cathode_Red) ; port OUT39
NetLED25_C1: LED48.C1(Cathode_Blue) ; port OUT34
NetLED25_C2: LED48.C2(Cathode_Green) ; port OUT35
NetLED25_C3: LED48.C3(Cathode_Red) ; port OUT36
NetLED26_C1: LED49.C1(Cathode_Blue) ; port OUT31
NetLED26_C2: LED49.C2(Cathode_Green) ; port OUT32
NetLED26_C3: LED49.C3(Cathode_Red) ; port OUT33
NetLED27_C1: LED50.C1(Cathode_Blue) ; port OUT28
NetLED27_C2: LED50.C2(Cathode_Green) ; port OUT29
NetLED27_C3: LED50.C3(Cathode_Red) ; port OUT30
NetLED28_C1: LED51.C1(Cathode_Blue) ; port OUT25
NetLED28_C2: LED51.C2(Cathode_Green) ; port OUT26
NetLED28_C3: LED51.C3(Cathode_Red) ; port OUT27
NetLED29_C1: LED52.C1(Cathode_Blue) ; port OUT22
NetLED29_C2: LED52.C2(Cathode_Green) ; port OUT23
NetLED29_C3: LED52.C3(Cathode_Red) ; port OUT24

### Notes on the sheet
- Title
- Size:
- Date:
- B
- Author:
- Time:
- Sheet
- Revision:
- of
- File:

### Library data of the parts
LED30-LED53 = LRTB_R98G: IC RGB LED OSRAM; Manufacturer: OSRAM

## Sheet LEDS3.SchDoc: LEDBO - LRTBR98G (LEDS 3)
size B; Author: Sébastien Gélinas; Organization: SmartHalo; Address1: 5445 de Gaspé; Address2: Montréal, QC; Address3: Canada; Address4: H2T 3B2; Revision: 1; SheetNumber: 5; SheetTotal: 5
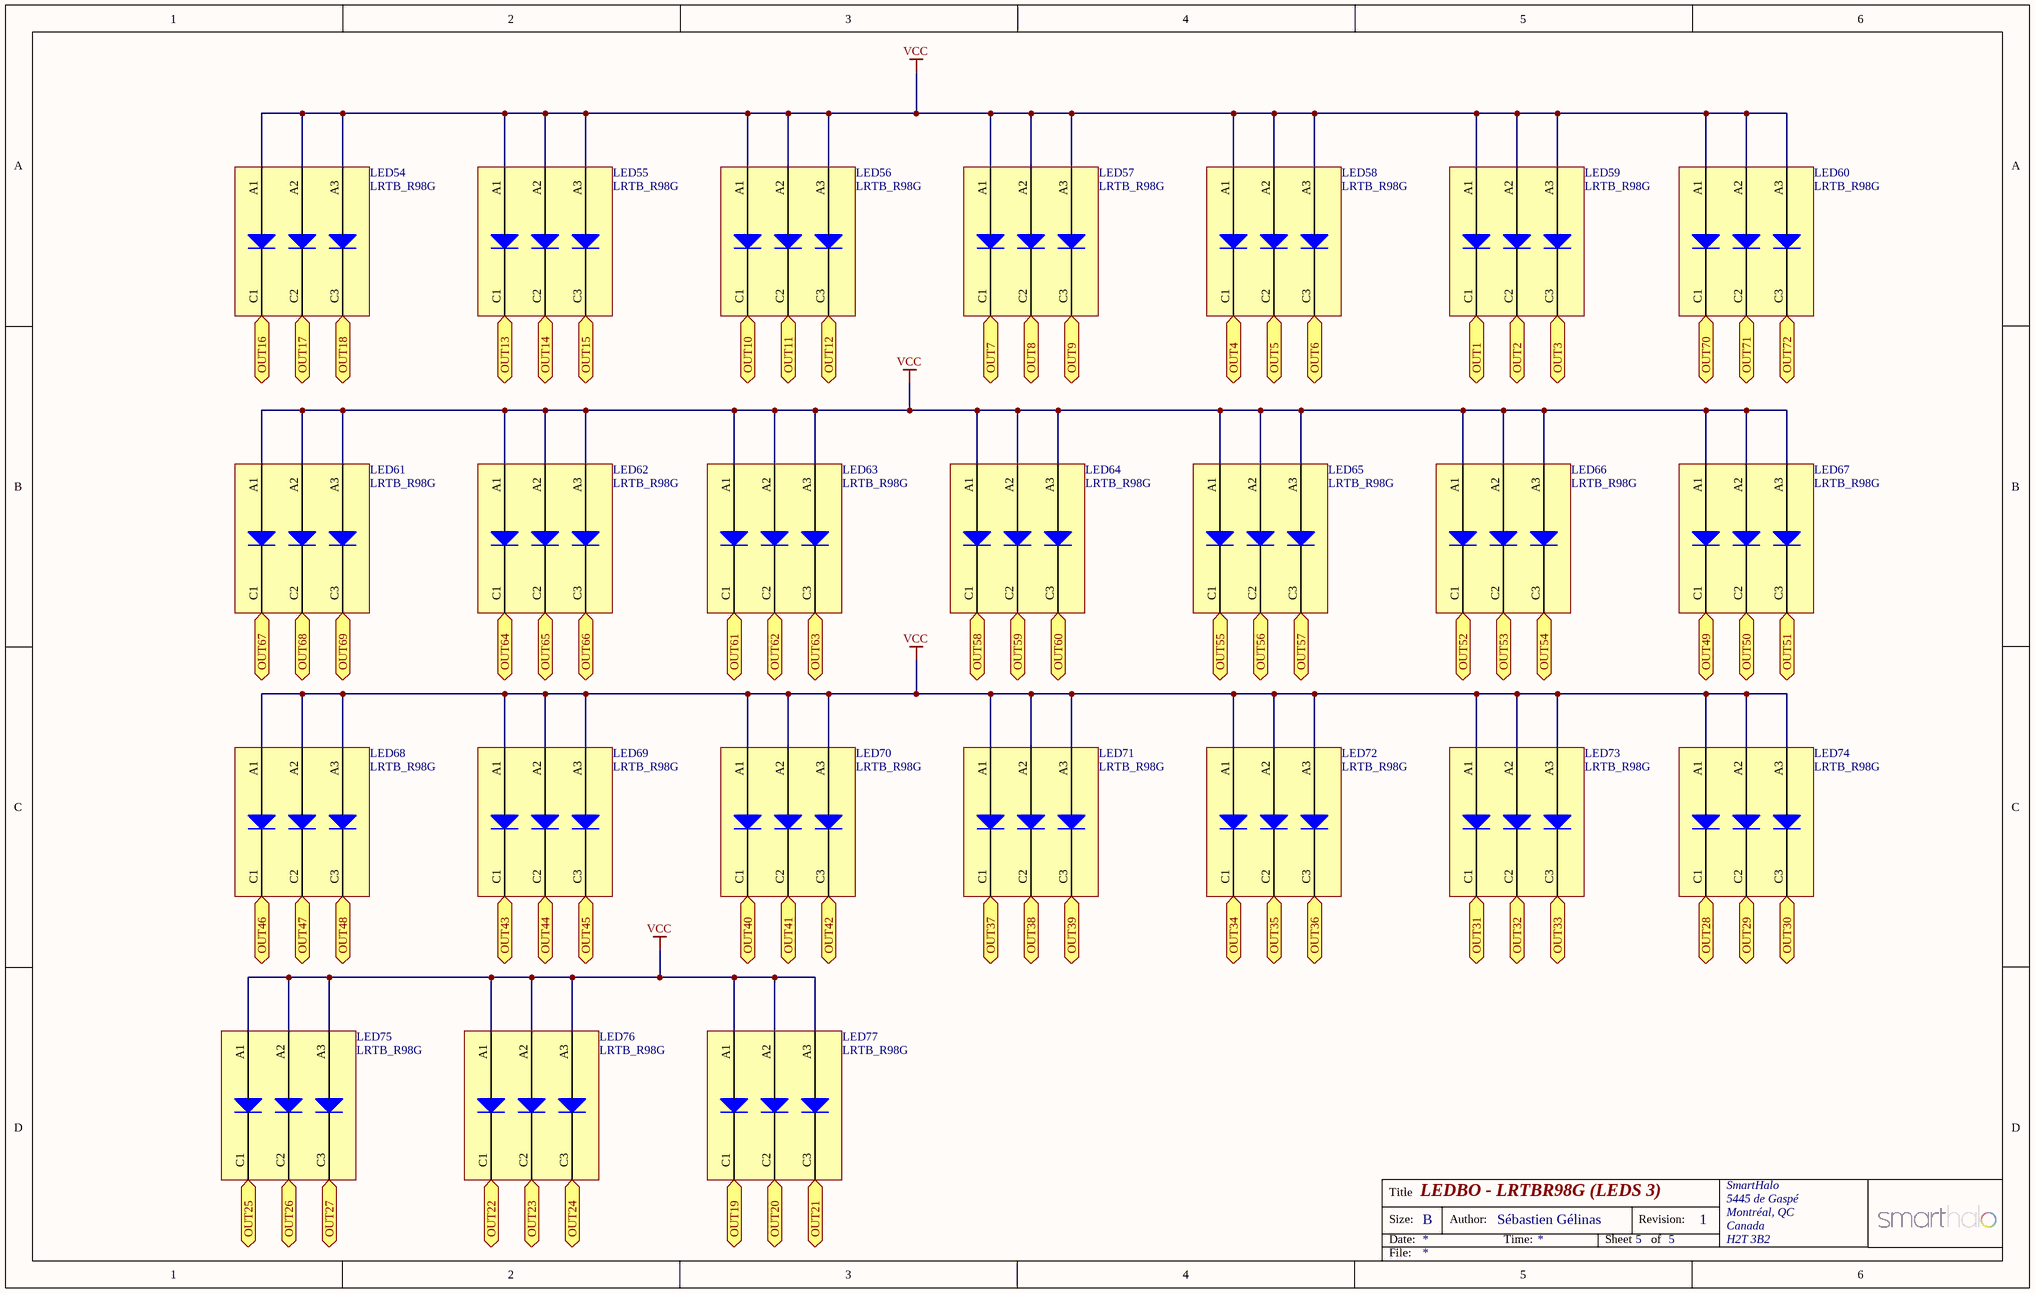
[diagram p4: LEDS3.SchDoc]

### Parts
LED54  LRTB_R98G  [LRTB_R98G]
LED55  LRTB_R98G  [LRTB_R98G]
LED56  LRTB_R98G  [LRTB_R98G]
LED57  LRTB_R98G  [LRTB_R98G]
LED58  LRTB_R98G  [LRTB_R98G]
LED59  LRTB_R98G  [LRTB_R98G]
LED60  LRTB_R98G  [LRTB_R98G]
LED61  LRTB_R98G  [LRTB_R98G]
LED62  LRTB_R98G  [LRTB_R98G]
LED63  LRTB_R98G  [LRTB_R98G]
LED64  LRTB_R98G  [LRTB_R98G]
LED65  LRTB_R98G  [LRTB_R98G]
LED66  LRTB_R98G  [LRTB_R98G]
LED67  LRTB_R98G  [LRTB_R98G]
LED68  LRTB_R98G  [LRTB_R98G]
LED69  LRTB_R98G  [LRTB_R98G]
LED70  LRTB_R98G  [LRTB_R98G]
LED71  LRTB_R98G  [LRTB_R98G]
LED72  LRTB_R98G  [LRTB_R98G]
LED73  LRTB_R98G  [LRTB_R98G]
LED74  LRTB_R98G  [LRTB_R98G]
LED75  LRTB_R98G  [LRTB_R98G]
LED76  LRTB_R98G  [LRTB_R98G]
LED77  LRTB_R98G  [LRTB_R98G]

### Ports
OUT1, OUT2, OUT3, OUT4, OUT5, OUT6, OUT7, OUT8, OUT9, OUT10, OUT11, OUT12, OUT13, OUT14, OUT15, OUT16, OUT17, OUT18, OUT19, OUT20, OUT21, OUT22, OUT23, OUT24, OUT25, OUT26, OUT27, OUT28, OUT29, OUT30, OUT31, OUT32, OUT33, OUT34, OUT35, OUT36, OUT37, OUT38, OUT39, OUT40, OUT41, OUT42, OUT43, OUT44, OUT45, OUT46, OUT47, OUT48, OUT49, OUT50, OUT51, OUT52, OUT53, OUT54, OUT55, OUT56, OUT57, OUT58, OUT59, OUT60, OUT61, OUT62, OUT63, OUT64, OUT65, OUT66, OUT67, OUT68, OUT69, OUT70, OUT71, OUT72

### Nets
VCC: LED54.A1(Anode_Blue) LED54.A2(Anode_Green) LED54.A3(Anode_Red) LED55.A1(Anode_Blue) LED55.A2(Anode_Green) LED55.A3(Anode_Red) LED56.A1(Anode_Blue) LED56.A2(Anode_Green) LED56.A3(Anode_Red) LED57.A1(Anode_Blue) LED57.A2(Anode_Green) LED57.A3(Anode_Red) LED58.A1(Anode_Blue) LED58.A2(Anode_Green) LED58.A3(Anode_Red) LED59.A1(Anode_Blue) LED59.A2(Anode_Green) LED59.A3(Anode_Red) LED60.A1(Anode_Blue) LED60.A2(Anode_Green) LED60.A3(Anode_Red) LED61.A1(Anode_Blue) LED61.A2(Anode_Green) LED61.A3(Anode_Red) LED62.A1(Anode_Blue) LED62.A2(Anode_Green) LED62.A3(Anode_Red) LED63.A1(Anode_Blue) LED63.A2(Anode_Green) LED63.A3(Anode_Red) LED64.A1(Anode_Blue) LED64.A2(Anode_Green) LED64.A3(Anode_Red) LED65.A1(Anode_Blue) LED65.A2(Anode_Green) LED65.A3(Anode_Red) LED66.A1(Anode_Blue) LED66.A2(Anode_Green) LED66.A3(Anode_Red) LED67.A1(Anode_Blue) LED67.A2(Anode_Green) LED67.A3(Anode_Red) LED68.A1(Anode_Blue) LED68.A2(Anode_Green) LED68.A3(Anode_Red) LED69.A1(Anode_Blue) LED69.A2(Anode_Green) LED69.A3(Anode_Red) LED70.A1(Anode_Blue) LED70.A2(Anode_Green) LED70.A3(Anode_Red) LED71.A1(Anode_Blue) LED71.A2(Anode_Green) LED71.A3(Anode_Red) LED72.A1(Anode_Blue) LED72.A2(Anode_Green) LED72.A3(Anode_Red) LED73.A1(Anode_Blue) LED73.A2(Anode_Green) LED73.A3(Anode_Red) LED74.A1(Anode_Blue) LED74.A2(Anode_Green) LED74.A3(Anode_Red) LED75.A1(Anode_Blue) LED75.A2(Anode_Green) LED75.A3(Anode_Red) LED76.A1(Anode_Blue) LED76.A2(Anode_Green) LED76.A3(Anode_Red) LED77.A1(Anode_Blue) LED77.A2(Anode_Green) LED77.A3(Anode_Red)
NetLED6_C1: LED77.C1(Cathode_Blue) ; port OUT19
NetLED6_C2: LED77.C2(Cathode_Green) ; port OUT20
NetLED6_C3: LED77.C3(Cathode_Red) ; port OUT21
NetLED7_C1: LED54.C1(Cathode_Blue) ; port OUT16
NetLED7_C2: LED54.C2(Cathode_Green) ; port OUT17
NetLED7_C3: LED54.C3(Cathode_Red) ; port OUT18
NetLED8_C1: LED55.C1(Cathode_Blue) ; port OUT13
NetLED8_C2: LED55.C2(Cathode_Green) ; port OUT14
NetLED8_C3: LED55.C3(Cathode_Red) ; port OUT15
NetLED9_C1: LED56.C1(Cathode_Blue) ; port OUT10
NetLED9_C2: LED56.C2(Cathode_Green) ; port OUT11
NetLED9_C3: LED56.C3(Cathode_Red) ; port OUT12
NetLED10_C1: LED57.C1(Cathode_Blue) ; port OUT7
NetLED10_C2: LED57.C2(Cathode_Green) ; port OUT8
NetLED10_C3: LED57.C3(Cathode_Red) ; port OUT9
NetLED11_C1: LED58.C1(Cathode_Blue) ; port OUT4
NetLED11_C2: LED58.C2(Cathode_Green) ; port OUT5
NetLED11_C3: LED58.C3(Cathode_Red) ; port OUT6
NetLED12_C1: LED59.C1(Cathode_Blue) ; port OUT1
NetLED12_C2: LED59.C2(Cathode_Green) ; port OUT2
NetLED12_C3: LED59.C3(Cathode_Red) ; port OUT3
NetLED13_C1: LED60.C1(Cathode_Blue) ; port OUT70
NetLED13_C2: LED60.C2(Cathode_Green) ; port OUT71
NetLED13_C3: LED60.C3(Cathode_Red) ; port OUT72
NetLED14_C1: LED61.C1(Cathode_Blue) ; port OUT67
NetLED14_C2: LED61.C2(Cathode_Green) ; port OUT68
NetLED14_C3: LED61.C3(Cathode_Red) ; port OUT69
NetLED15_C1: LED62.C1(Cathode_Blue) ; port OUT64
NetLED15_C2: LED62.C2(Cathode_Green) ; port OUT65
NetLED15_C3: LED62.C3(Cathode_Red) ; port OUT66
NetLED16_C1: LED63.C1(Cathode_Blue) ; port OUT61
NetLED16_C2: LED63.C2(Cathode_Green) ; port OUT62
NetLED16_C3: LED63.C3(Cathode_Red) ; port OUT63
NetLED17_C1: LED64.C1(Cathode_Blue) ; port OUT58
NetLED17_C2: LED64.C2(Cathode_Green) ; port OUT59
NetLED17_C3: LED64.C3(Cathode_Red) ; port OUT60
NetLED18_C1: LED65.C1(Cathode_Blue) ; port OUT55
NetLED18_C2: LED65.C2(Cathode_Green) ; port OUT56
NetLED18_C3: LED65.C3(Cathode_Red) ; port OUT57
NetLED19_C1: LED66.C1(Cathode_Blue) ; port OUT52
NetLED19_C2: LED66.C2(Cathode_Green) ; port OUT53
NetLED19_C3: LED66.C3(Cathode_Red) ; port OUT54
NetLED20_C1: LED67.C1(Cathode_Blue) ; port OUT49
NetLED20_C2: LED67.C2(Cathode_Green) ; port OUT50
NetLED20_C3: LED67.C3(Cathode_Red) ; port OUT51
NetLED21_C1: LED68.C1(Cathode_Blue) ; port OUT46
NetLED21_C2: LED68.C2(Cathode_Green) ; port OUT47
NetLED21_C3: LED68.C3(Cathode_Red) ; port OUT48
NetLED22_C1: LED69.C1(Cathode_Blue) ; port OUT43
NetLED22_C2: LED69.C2(Cathode_Green) ; port OUT44
NetLED22_C3: LED69.C3(Cathode_Red) ; port OUT45
NetLED23_C1: LED70.C1(Cathode_Blue) ; port OUT40
NetLED23_C2: LED70.C2(Cathode_Green) ; port OUT41
NetLED23_C3: LED70.C3(Cathode_Red) ; port OUT42
NetLED24_C1: LED71.C1(Cathode_Blue) ; port OUT37
NetLED24_C2: LED71.C2(Cathode_Green) ; port OUT38
NetLED24_C3: LED71.C3(Cathode_Red) ; port OUT39
NetLED25_C1: LED72.C1(Cathode_Blue) ; port OUT34
NetLED25_C2: LED72.C2(Cathode_Green) ; port OUT35
NetLED25_C3: LED72.C3(Cathode_Red) ; port OUT36
NetLED26_C1: LED73.C1(Cathode_Blue) ; port OUT31
NetLED26_C2: LED73.C2(Cathode_Green) ; port OUT32
NetLED26_C3: LED73.C3(Cathode_Red) ; port OUT33
NetLED27_C1: LED74.C1(Cathode_Blue) ; port OUT28
NetLED27_C2: LED74.C2(Cathode_Green) ; port OUT29
NetLED27_C3: LED74.C3(Cathode_Red) ; port OUT30
NetLED28_C1: LED75.C1(Cathode_Blue) ; port OUT25
NetLED28_C2: LED75.C2(Cathode_Green) ; port OUT26
NetLED28_C3: LED75.C3(Cathode_Red) ; port OUT27
NetLED29_C1: LED76.C1(Cathode_Blue) ; port OUT22
NetLED29_C2: LED76.C2(Cathode_Green) ; port OUT23
NetLED29_C3: LED76.C3(Cathode_Red) ; port OUT24

### Notes on the sheet
- Title
- Size:
- Date:
- B
- Author:
- Time:
- Sheet
- Revision:
- of
- File:

### Library data of the parts
LED54-LED77 = LRTB_R98G: IC RGB LED OSRAM; Manufacturer: OSRAM

## Nets that join several sheets
VCC: DRIVERS_CONNECTORS (13 pins), LEDS1 (72 pins), LEDS2 (72 pins), LEDS3 (72 pins)
ANODE_B: DRIVERS_CONNECTORS (R6.1), CENTRALLEDS (5 pins)
ANODE_G: DRIVERS_CONNECTORS (R7.1), CENTRALLEDS (5 pins)
ANODE_R: DRIVERS_CONNECTORS (R4.1), CENTRALLEDS (5 pins)
NetLED1_C1: DRIVERS_CONNECTORS (Q1.6), CENTRALLEDS (5 pins)
NetLED1_C2: DRIVERS_CONNECTORS (Q1.3), CENTRALLEDS (5 pins)
NetLED1_C3: DRIVERS_CONNECTORS (Q2.6), CENTRALLEDS (5 pins)
NetLED6_C1: DRIVERS_CONNECTORS (U1.20), LEDS1 (LED6.C1), LEDS2 (LED53.C1), LEDS3 (LED77.C1)
NetLED6_C2: DRIVERS_CONNECTORS (U1.21), LEDS1 (LED6.C2), LEDS2 (LED53.C2), LEDS3 (LED77.C2)
NetLED6_C3: DRIVERS_CONNECTORS (U1.22), LEDS1 (LED6.C3), LEDS2 (LED53.C3), LEDS3 (LED77.C3)
NetLED7_C1: DRIVERS_CONNECTORS (U1.15), LEDS1 (LED7.C1), LEDS2 (LED30.C1), LEDS3 (LED54.C1)
NetLED7_C2: DRIVERS_CONNECTORS (U1.16), LEDS1 (LED7.C2), LEDS2 (LED30.C2), LEDS3 (LED54.C2)
NetLED7_C3: DRIVERS_CONNECTORS (U1.17), LEDS1 (LED7.C3), LEDS2 (LED30.C3), LEDS3 (LED54.C3)
NetLED8_C1: DRIVERS_CONNECTORS (U1.12), LEDS1 (LED8.C1), LEDS2 (LED31.C1), LEDS3 (LED55.C1)
NetLED8_C2: DRIVERS_CONNECTORS (U1.13), LEDS1 (LED8.C2), LEDS2 (LED31.C2), LEDS3 (LED55.C2)
NetLED8_C3: DRIVERS_CONNECTORS (U1.14), LEDS1 (LED8.C3), LEDS2 (LED31.C3), LEDS3 (LED55.C3)
NetLED9_C1: DRIVERS_CONNECTORS (U1.9), LEDS1 (LED9.C1), LEDS2 (LED32.C1), LEDS3 (LED56.C1)
NetLED9_C2: DRIVERS_CONNECTORS (U1.10), LEDS1 (LED9.C2), LEDS2 (LED32.C2), LEDS3 (LED56.C2)
NetLED9_C3: DRIVERS_CONNECTORS (U1.11), LEDS1 (LED9.C3), LEDS2 (LED32.C3), LEDS3 (LED56.C3)
NetLED10_C1: DRIVERS_CONNECTORS (U1.6), LEDS1 (LED10.C1), LEDS2 (LED33.C1), LEDS3 (LED57.C1)
NetLED10_C2: DRIVERS_CONNECTORS (U1.7), LEDS1 (LED10.C2), LEDS2 (LED33.C2), LEDS3 (LED57.C2)
NetLED10_C3: DRIVERS_CONNECTORS (U1.8), LEDS1 (LED10.C3), LEDS2 (LED33.C3), LEDS3 (LED57.C3)
NetLED11_C1: DRIVERS_CONNECTORS (U1.2), LEDS1 (LED11.C1), LEDS2 (LED34.C1), LEDS3 (LED58.C1)
NetLED11_C2: DRIVERS_CONNECTORS (U1.3), LEDS1 (LED11.C2), LEDS2 (LED34.C2), LEDS3 (LED58.C2)
NetLED11_C3: DRIVERS_CONNECTORS (U1.5), LEDS1 (LED11.C3), LEDS2 (LED34.C3), LEDS3 (LED58.C3)
NetLED12_C1: DRIVERS_CONNECTORS (U1.47), LEDS1 (LED12.C1), LEDS2 (LED35.C1), LEDS3 (LED59.C1)
NetLED12_C2: DRIVERS_CONNECTORS (U1.48), LEDS1 (LED12.C2), LEDS2 (LED35.C2), LEDS3 (LED59.C2)
NetLED12_C3: DRIVERS_CONNECTORS (U1.1), LEDS1 (LED12.C3), LEDS2 (LED35.C3), LEDS3 (LED59.C3)
NetLED13_C1: DRIVERS_CONNECTORS (U2.36), LEDS1 (LED13.C1), LEDS2 (LED36.C1), LEDS3 (LED60.C1)
NetLED13_C2: DRIVERS_CONNECTORS (U2.37), LEDS1 (LED13.C2), LEDS2 (LED36.C2), LEDS3 (LED60.C2)
NetLED13_C3: DRIVERS_CONNECTORS (U2.38), LEDS1 (LED13.C3), LEDS2 (LED36.C3), LEDS3 (LED60.C3)
NetLED14_C1: DRIVERS_CONNECTORS (U2.32), LEDS1 (LED14.C1), LEDS2 (LED37.C1), LEDS3 (LED61.C1)
NetLED14_C2: DRIVERS_CONNECTORS (U2.34), LEDS1 (LED14.C2), LEDS2 (LED37.C2), LEDS3 (LED61.C2)
NetLED14_C3: DRIVERS_CONNECTORS (U2.35), LEDS1 (LED14.C3), LEDS2 (LED37.C3), LEDS3 (LED61.C3)
NetLED15_C1: DRIVERS_CONNECTORS (U2.29), LEDS1 (LED15.C1), LEDS2 (LED38.C1), LEDS3 (LED62.C1)
NetLED15_C2: DRIVERS_CONNECTORS (U2.30), LEDS1 (LED15.C2), LEDS2 (LED38.C2), LEDS3 (LED62.C2)
NetLED15_C3: DRIVERS_CONNECTORS (U2.31), LEDS1 (LED15.C3), LEDS2 (LED38.C3), LEDS3 (LED62.C3)
NetLED16_C1: DRIVERS_CONNECTORS (U2.26), LEDS1 (LED16.C1), LEDS2 (LED39.C1), LEDS3 (LED63.C1)
NetLED16_C2: DRIVERS_CONNECTORS (U2.27), LEDS1 (LED16.C2), LEDS2 (LED39.C2), LEDS3 (LED63.C2)
NetLED16_C3: DRIVERS_CONNECTORS (U2.28), LEDS1 (LED16.C3), LEDS2 (LED39.C3), LEDS3 (LED63.C3)
NetLED17_C1: DRIVERS_CONNECTORS (U2.23), LEDS1 (LED17.C1), LEDS2 (LED40.C1), LEDS3 (LED64.C1)
NetLED17_C2: DRIVERS_CONNECTORS (U2.24), LEDS1 (LED17.C2), LEDS2 (LED40.C2), LEDS3 (LED64.C2)
NetLED17_C3: DRIVERS_CONNECTORS (U2.25), LEDS1 (LED17.C3), LEDS2 (LED40.C3), LEDS3 (LED64.C3)
NetLED18_C1: DRIVERS_CONNECTORS (U2.20), LEDS1 (LED18.C1), LEDS2 (LED41.C1), LEDS3 (LED65.C1)
NetLED18_C2: DRIVERS_CONNECTORS (U2.21), LEDS1 (LED18.C2), LEDS2 (LED41.C2), LEDS3 (LED65.C2)
NetLED18_C3: DRIVERS_CONNECTORS (U2.22), LEDS1 (LED18.C3), LEDS2 (LED41.C3), LEDS3 (LED65.C3)
NetLED19_C1: DRIVERS_CONNECTORS (U2.15), LEDS1 (LED19.C1), LEDS2 (LED42.C1), LEDS3 (LED66.C1)
NetLED19_C2: DRIVERS_CONNECTORS (U2.16), LEDS1 (LED19.C2), LEDS2 (LED42.C2), LEDS3 (LED66.C2)
NetLED19_C3: DRIVERS_CONNECTORS (U2.17), LEDS1 (LED19.C3), LEDS2 (LED42.C3), LEDS3 (LED66.C3)
NetLED20_C1: DRIVERS_CONNECTORS (U2.12), LEDS1 (LED20.C1), LEDS2 (LED43.C1), LEDS3 (LED67.C1)
NetLED20_C2: DRIVERS_CONNECTORS (U2.13), LEDS1 (LED20.C2), LEDS2 (LED43.C2), LEDS3 (LED67.C2)
NetLED20_C3: DRIVERS_CONNECTORS (U2.14), LEDS1 (LED20.C3), LEDS2 (LED43.C3), LEDS3 (LED67.C3)
NetLED21_C1: DRIVERS_CONNECTORS (U2.9), LEDS1 (LED21.C1), LEDS2 (LED44.C1), LEDS3 (LED68.C1)
NetLED21_C2: DRIVERS_CONNECTORS (U2.10), LEDS1 (LED21.C2), LEDS2 (LED44.C2), LEDS3 (LED68.C2)
NetLED21_C3: DRIVERS_CONNECTORS (U2.11), LEDS1 (LED21.C3), LEDS2 (LED44.C3), LEDS3 (LED68.C3)
NetLED22_C1: DRIVERS_CONNECTORS (U2.6), LEDS1 (LED22.C1), LEDS2 (LED45.C1), LEDS3 (LED69.C1)
NetLED22_C2: DRIVERS_CONNECTORS (U2.7), LEDS1 (LED22.C2), LEDS2 (LED45.C2), LEDS3 (LED69.C2)
NetLED22_C3: DRIVERS_CONNECTORS (U2.8), LEDS1 (LED22.C3), LEDS2 (LED45.C3), LEDS3 (LED69.C3)
NetLED23_C1: DRIVERS_CONNECTORS (U2.2), LEDS1 (LED23.C1), LEDS2 (LED46.C1), LEDS3 (LED70.C1)
NetLED23_C2: DRIVERS_CONNECTORS (U2.3), LEDS1 (LED23.C2), LEDS2 (LED46.C2), LEDS3 (LED70.C2)
NetLED23_C3: DRIVERS_CONNECTORS (U2.5), LEDS1 (LED23.C3), LEDS2 (LED46.C3), LEDS3 (LED70.C3)
NetLED24_C1: DRIVERS_CONNECTORS (U2.47), LEDS1 (LED24.C1), LEDS2 (LED47.C1), LEDS3 (LED71.C1)
NetLED24_C2: DRIVERS_CONNECTORS (U2.48), LEDS1 (LED24.C2), LEDS2 (LED47.C2), LEDS3 (LED71.C2)
NetLED24_C3: DRIVERS_CONNECTORS (U2.1), LEDS1 (LED24.C3), LEDS2 (LED47.C3), LEDS3 (LED71.C3)
NetLED25_C1: DRIVERS_CONNECTORS (U1.36), LEDS1 (LED25.C1), LEDS2 (LED48.C1), LEDS3 (LED72.C1)
NetLED25_C2: DRIVERS_CONNECTORS (U1.37), LEDS1 (LED25.C2), LEDS2 (LED48.C2), LEDS3 (LED72.C2)
NetLED25_C3: DRIVERS_CONNECTORS (U1.38), LEDS1 (LED25.C3), LEDS2 (LED48.C3), LEDS3 (LED72.C3)
NetLED26_C1: DRIVERS_CONNECTORS (U1.32), LEDS1 (LED26.C1), LEDS2 (LED49.C1), LEDS3 (LED73.C1)
NetLED26_C2: DRIVERS_CONNECTORS (U1.34), LEDS1 (LED26.C2), LEDS2 (LED49.C2), LEDS3 (LED73.C2)
NetLED26_C3: DRIVERS_CONNECTORS (U1.35), LEDS1 (LED26.C3), LEDS2 (LED49.C3), LEDS3 (LED73.C3)
NetLED27_C1: DRIVERS_CONNECTORS (U1.29), LEDS1 (LED27.C1), LEDS2 (LED50.C1), LEDS3 (LED74.C1)
NetLED27_C2: DRIVERS_CONNECTORS (U1.30), LEDS1 (LED27.C2), LEDS2 (LED50.C2), LEDS3 (LED74.C2)
NetLED27_C3: DRIVERS_CONNECTORS (U1.31), LEDS1 (LED27.C3), LEDS2 (LED50.C3), LEDS3 (LED74.C3)
NetLED28_C1: DRIVERS_CONNECTORS (U1.26), LEDS1 (LED28.C1), LEDS2 (LED51.C1), LEDS3 (LED75.C1)
NetLED28_C2: DRIVERS_CONNECTORS (U1.27), LEDS1 (LED28.C2), LEDS2 (LED51.C2), LEDS3 (LED75.C2)
NetLED28_C3: DRIVERS_CONNECTORS (U1.28), LEDS1 (LED28.C3), LEDS2 (LED51.C3), LEDS3 (LED75.C3)
NetLED29_C1: DRIVERS_CONNECTORS (U1.23), LEDS1 (LED29.C1), LEDS2 (LED52.C1), LEDS3 (LED76.C1)
NetLED29_C2: DRIVERS_CONNECTORS (U1.24), LEDS1 (LED29.C2), LEDS2 (LED52.C2), LEDS3 (LED76.C2)
NetLED29_C3: DRIVERS_CONNECTORS (U1.25), LEDS1 (LED29.C3), LEDS2 (LED52.C3), LEDS3 (LED76.C3)